# Altium schematic sheet solar_cell.SchDoc
size A; SheetNumber: 8; SheetTotal: 8
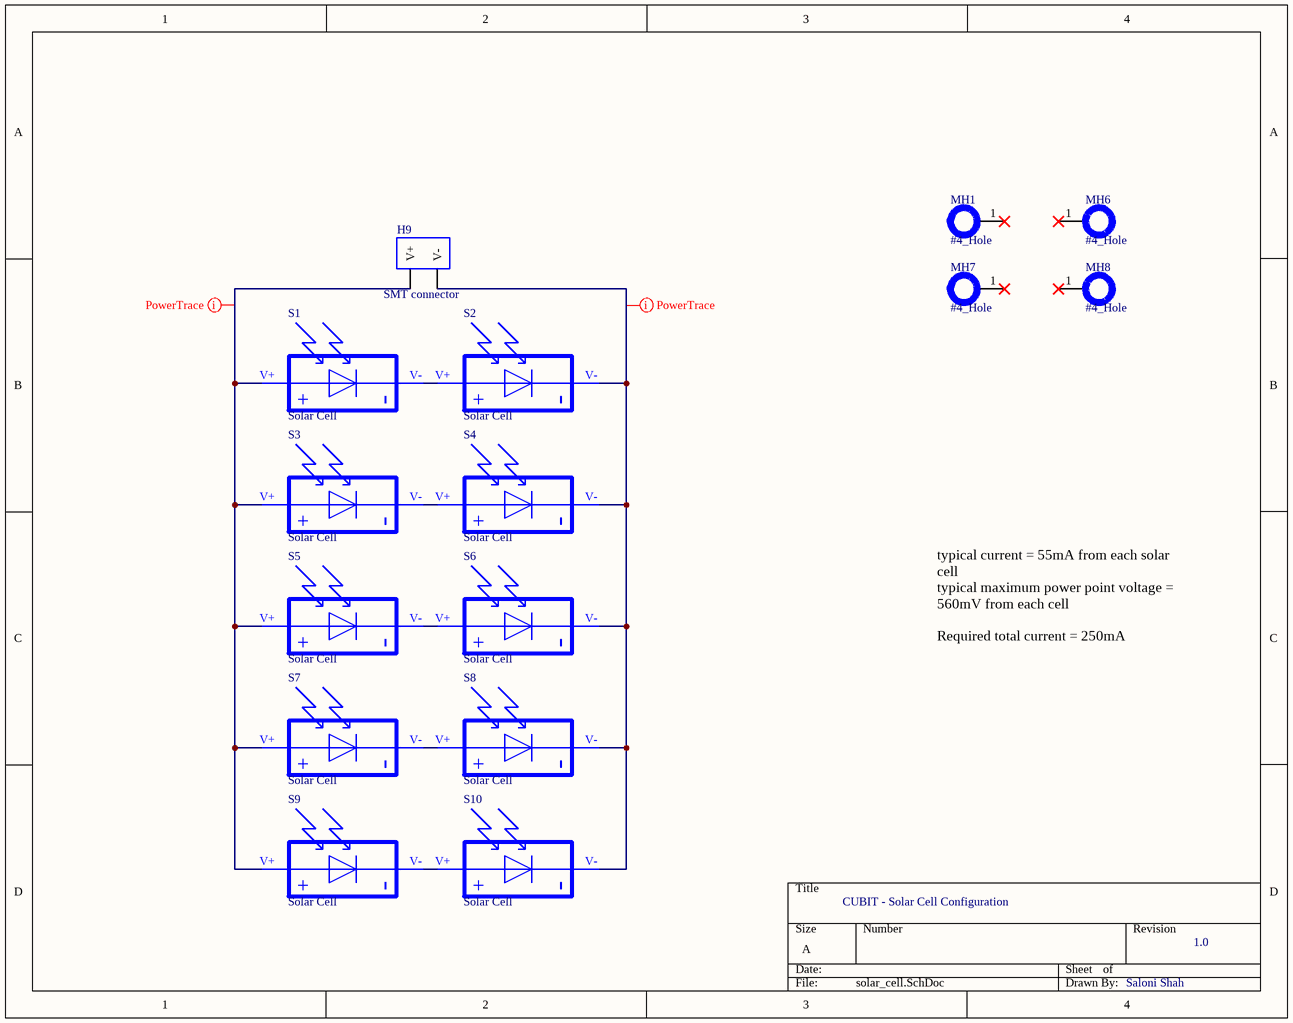
[diagram p0: solar_cell.SchDoc]

## Parts
H9  SMT connector  [BAT_CONN]
MH1  #4_Hole  [HOLE_#4]
MH6  #4_Hole  [HOLE_#4]
MH7  #4_Hole  [HOLE_#4]
MH8  #4_Hole  [HOLE_#4]
S1  Solar Cell  [KXOB25-14X1F]
S2  Solar Cell  [KXOB25-14X1F]
S3  Solar Cell  [KXOB25-14X1F]
S4  Solar Cell  [KXOB25-14X1F]
S5  Solar Cell  [KXOB25-14X1F]
S6  Solar Cell  [KXOB25-14X1F]
S7  Solar Cell  [KXOB25-14X1F]
S8  Solar Cell  [KXOB25-14X1F]
S9  Solar Cell  [KXOB25-14X1F]
S10  Solar Cell  [KXOB25-14X1F]

## Nets
NetH9_V+: H9.V+ S1.V+ S3.V+ S5.V+ S7.V+ S9.V+
NetH9_V-: H9.V- S2.V- S4.V- S6.V- S8.V- S10.V-
NetS1_V-: S1.V- S2.V+
NetS3_V-: S3.V- S4.V+
NetS5_V-: S5.V- S6.V+
NetS7_V-: S7.V- S8.V+
NetS9_V-: S9.V- S10.V+

Not connected (* = marked no-connect by the designer): MH1 1*; MH6 1*; MH7 1*; MH8 1*

## Layout directives
rule Width Constraint [Pref Width = 20mil    Min Width = 20mil    Max Width = 100mil]: NetH9_V+, NetH9_V-

## Notes on the sheet
- typical current = 55mA from each solar cell
  typical maximum power point voltage = 560mV from each cell
  Required total current = 250mA
- CUBIT - Solar Cell Configuration
- 1.0
- Saloni Shah
- (in symbol KXOB25-14X1F) +; -

## Library data of the parts
H9 = batt_conn_pad: 2.00mm Pitch
MH1 MH6-MH8 = Mechanical_Hole
S1-S10 = KXOB25-14X1F: Monocrystalline SOLAR CELL 30.7MW 690MV; Manufacturer: ANYSOLAR; Manufacturer Part Number: KXOB25-14X1F-TR; MF: ANYSOLAR Ltd; Price: None; MP: KXOB25-14X1F; Availability: Bad; SnapEDA_Link: https://www.snapeda.com/parts/KXOB25-14X1F/Sola/view-part/5163586/?ref=snap; Value: *; Package: None; Check_prices: https://www.snapeda.com/parts/KXOB25-14X1F/Sola/view-part/5163586/?ref=eda; Supplier 1: Digikey; RoHS: No; Stock 1: 2087; Pricing 1: 1=2.92, 10=2.474, 50=2.2094, 100=2.0958, 250=1.96952, 500=1.8685 (USD)